# Altium schematic sheet Sheet1.SCHDOC
size 420 x 297 mm; SheetNumber: 1; SheetTotal: 1; DocumentName: Sheet1.SCHDOC
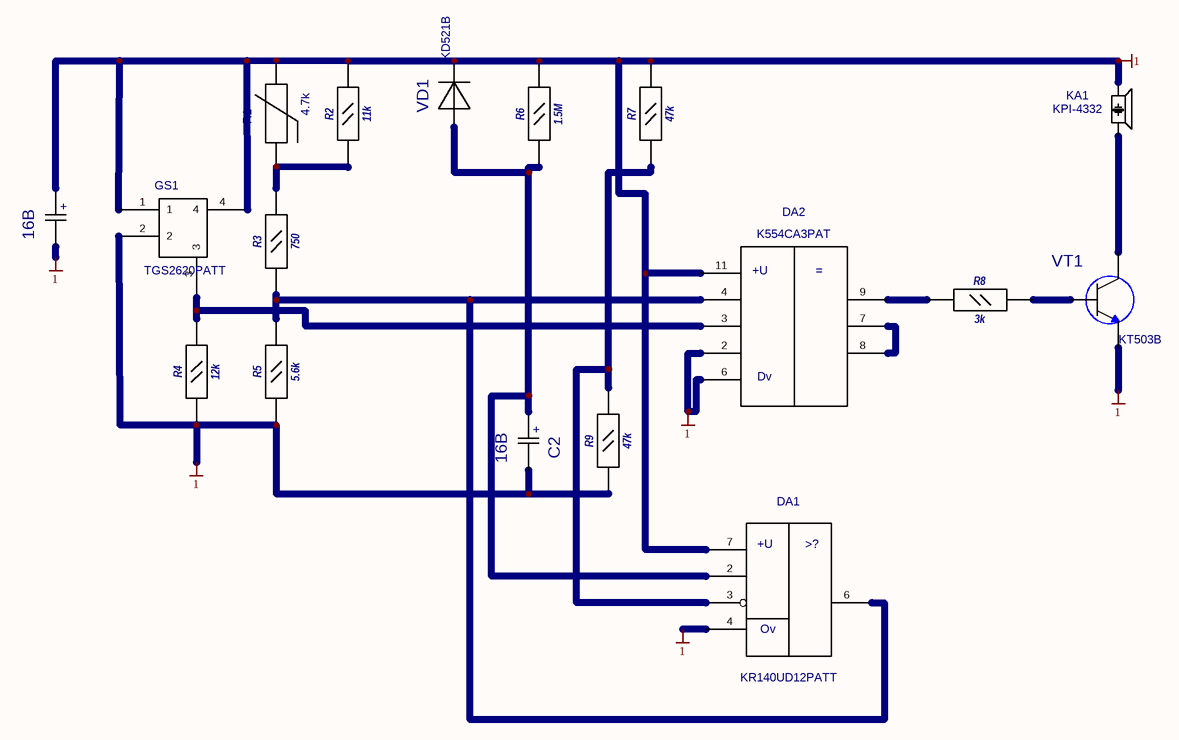
[diagram p0: Sheet1.SCHDOC]

## Parts
C2  value 16B  [CAP2]  (hidden comment: CAP2)
C3  value 16B  [CAP2]  (hidden comment: CAP2)
DA1  KR140UD12PATT  [KR140UD12PATT]
DA2  K554CA3PAT  [K554CA3PAT]
GS1  TGS2620PATT  [TGS2620PATT]
KA1  value KPI-4332  [ZP_LB1209]  (hidden comment: LB1209)
R1  value 4.7k  [TERMO_RES_PATT]  (hidden comment: TERMO_RES_PATT)
R2  value 11k  [МЛТ(0.125)]  (hidden comment: МЛТ(0.125))
R3  value 750  [МЛТ(0.125)]  (hidden comment: МЛТ(0.125))
R4  value 12k  [МЛТ(0.125)]  (hidden comment: МЛТ(0.125))
R5  value 5.6k  [МЛТ(0.125)]  (hidden comment: МЛТ(0.125))
R6  value 1.5M  [МЛТ(0.125)]  (hidden comment: МЛТ(0.125))
R7  value 47k  [МЛТ(0.125)]  (hidden comment: МЛТ(0.125))
R8  value 3k  [МЛТ(0.125)]  (hidden comment: МЛТ(0.125))
R9  value 47k  [МЛТ(0.125)]  (hidden comment: МЛТ(0.125))
VD1  value KD521B  [KD513A]  (hidden comment: KD513A)
VT1  value KT503B  [KT-13]  (hidden comment: KT315)

## Nets
1: C2.2 C3.1 C3.2 DA1.4 DA1.7 DA2.2 DA2.6 DA2.11 GS1.1 GS1.2 GS1.4 KA1.1 R1.2 R2.2 R4.1 R5.1 R6.2 R7.2 R9.1 VD1.1(I/O1) VT1.1(E)
GND: DA1.10(GND) DA2.10(GND)
VCC: DA1.8(Vcc) DA2.1(VCC)
NetC2_1: C2.1 DA1.2 R6.1 VD1.2(I/O2)
NetDA1_3: DA1.3 R7.1 R9.2
NetDA1_6: DA1.6 DA2.4 R3.1 R5.2
NetDA2_3: DA2.3 GS1.3 R4.2
NetDA2_7: DA2.7 DA2.8
NetDA2_9: DA2.9 R8.1
NetKA1_2: KA1.2 VT1.2(K)
NetR1_1: R1.1 R2.1 R3.2
NetR8_2: R8.2 VT1.3(B)

Not connected (* = marked no-connect by the designer): DA1 1 5 9 11 12 13 14; DA2 5 12 13 14

## Notes on the sheet
- (in symbol CAP2) +
- (in symbol K554CA3PAT) +U; Dv
- (in symbol KR140UD12PATT) +U; >?; Ov

## Library data of the parts
DA1 = KR140UD12PATT: Value: *
DA2 = K554CA3PAT: Value: *
GS1 = TGS2620PATT: Value: *